# EasyEDA Pro project 双路调光版v0.2（立创eda专业版文件）.epro

# Board PCB2
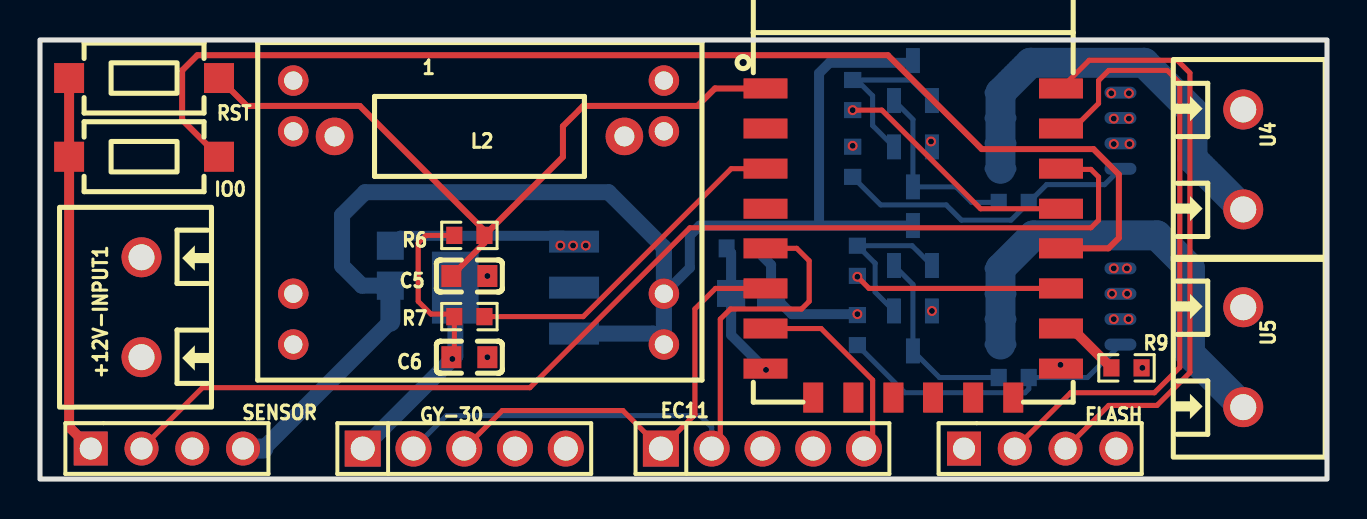
[diagram p0: board, top side]
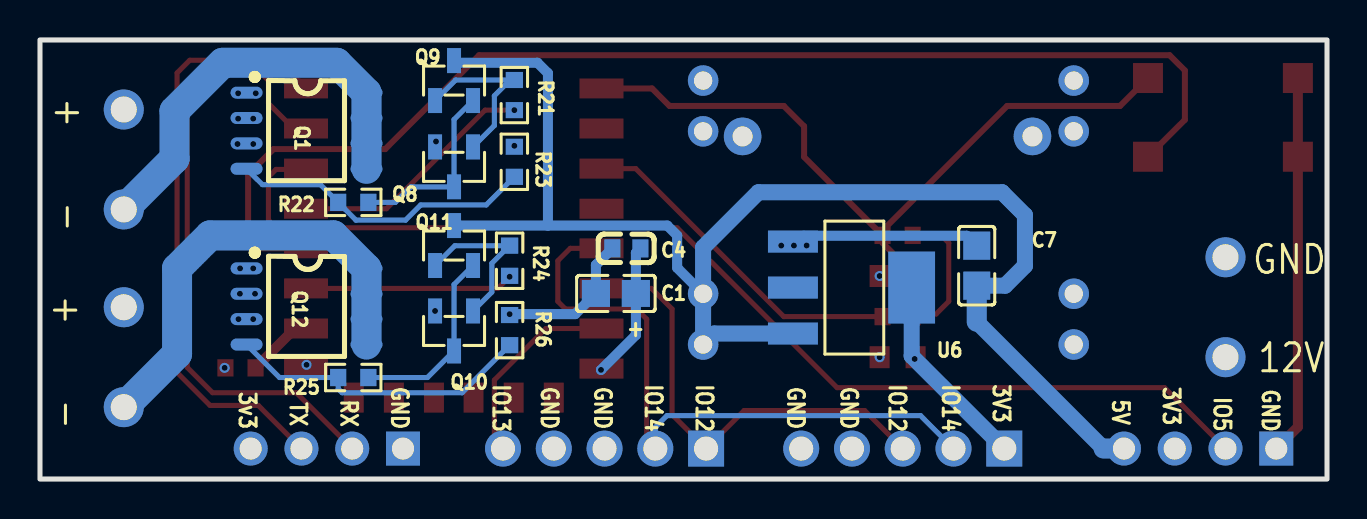
[diagram p1: board, bottom side, seen from below]

Outline 64.39 x 21.97 mm; copper layers: Top Layer, 电源层, GND层, Bottom Layer. Coordinates in mm from the lower left corner of the outline.
Outline path: rectangle 0,21.97 64.39,0
Stack: Top Layer 0.035mm 外层铜厚1oz / Dielectric1 0.2104mm 7628 RC49% 8.6mil / 电源层 0.0152mm 内层铜厚 / Dielectric2 1.065mm 1.1mm H/HOZ 含铜 / GND层 0.0152mm 内层铜厚 / Dielectric3 0.2104mm 7628 RC49% 8.6mil / Bottom Layer 0.035mm 外层铜厚1oz

## Design rules (mm)
template: 自定义配置
spacing copperThickness1oz (default): track to track 0.102, other pairs 0.152 to 0.3
spacing copperThickness2oz: track to track 0.203, other pairs 0.152 to 0.3
track width copperThickness1oz (default): min 0.127, default 0.254, max 3
track width copperThickness2oz: min 0.203, default 0.254, max 2.54
differential pair differentialPair (default): width min 0.127, default 0.254, max 2.54; gap min 0.152, default 0.152
via viaSize (default): diameter min 0.5, default 0.61, max 10; hole min 0.3, default 0.305, max 6.3

## Placement (name value [footprint] x y rotation side)
1  DC-DC  [电源模块]  22.45 12.83 0 top
+12V-INPUT1  SIP2  [CONN-TH_2P-P5.00_L7.6-W10.0]  5.08 8.6 90 top
C1  4.7uF  [C0805]  35.58 9.29 0 bottom
C4  0.1uf  [C0603#2]  35.05 11.54 180 bottom
C5  100nF  [C0603]  21.48 10.16 0 top
C6  100nF  [C0603]  21.48 6.1 180 top
C7  4.7uF  [C0805]  17.53 10.68 90 bottom
EC11  EC11  [HDR-TH_5P-P2.54-V_Z-211-0511-0021-001]  36.14 1.52 0 top
FLASH  FLASH  [HDR-TH_4P-P2.54-V]  50.04 1.52 0 top
GY-30  GY-30  [HDR-TH_5P-P2.54-V_Z-211-0511-0021-001]  21.23 1.52 0 top
IO0  BUTTON2,KEY  [KEY-SMD_L6.0-W3.5-LS8.0]  5.21 16.13 0 top
L2  磁环/0R电阻  [IND-TH_BD4.0-L10.5-P14.50-D0.6]  21.99 17.15 180 top
Q1  NCE3010S  [SOP-8_L4.9-W3.9-P1.27-LS6.0-BL]  51.05 17.43 270 bottom
Q8  S8550  [SOT-23-3_L2.9-W1.3-P1.90-LS2.4-BR]  43.67 15.62 90 bottom
Q9  S8050  [SOT-23-3_L2.9-W1.3-P1.90-LS2.4-BR]  43.67 19.94 270 bottom
Q10  S8550  [SOT-23-3_L2.9-W1.3-P1.90-LS2.4-BR]  43.67 7.41 90 bottom
Q11  S8050  [SOT-23-3_L2.9-W1.3-P1.90-LS2.4-BR]  43.67 11.68 270 bottom
Q12  NCE3010S  [SOP-8_L4.9-W3.9-P1.27-LS6.0-BL]  51.05 8.64 270 bottom
R6  10k  [R0603]  21.48 12.19 0 top
R7  10k  [R0603]  21.48 8.13 0 top
R9  10k  [R0603]  54.36 5.56 0 top
R21  100R  [R0603]  40.66 19.21 90 bottom
R22  100R  [R0603]  48.72 13.84 0 bottom
R23  10kΩ  [R0603]  40.66 15.88 270 bottom
R24  100R  [R0603]  40.89 10.92 90 bottom
R25  100R  [R0603]  48.72 5.08 0 bottom
R26  10kΩ  [R0603]  40.89 7.45 270 bottom
RST  BUTTON2,KEY  [KEY-SMD_L6.0-W3.5-LS8.0]  5.21 20.07 180 top
SENSOR  Sensor2  [HDR-TH_4P-P2.54-V]  6.35 1.53 0 top
U2  ESP8266-12F  [LGA22-2.0-24X16MM]  43.69 11.81 0 top
U4  WJ306V-5.0-2P-14-00A  [CONN-TH_2P-P5.00_L7.6-W10.0]  60.2 15.99 270 top
U5  WJ306V-5.0-2P-14-00A  [CONN-TH_2P-P5.00_L7.6-W10.0]  60.2 6.1 270 top
U6  AMS1117-3.3  [SOT-223-3_L6.5-W3.4-P2.30-LS7.0-BR]  23.75 9.58 0 bottom

## Footprints (pads in the part's own frame, mm; a bottom-side part is the same pattern mirrored in y, then rotated)
C0603
  rect 1x1.1 smd: 1(-0.9,0) 2(0.9,0)
C0603#2
  rect 0.8x0.9 smd: 1(-0.7,0) 2(0.7,0)
C0805
  rect 1.41x1.35 smd: 1(-1,0) 2(1,0)
CONN-TH_2P-P5.00_L7.6-W10.0
  round 2 hole 1.3: 1(-2.5,0) 2(2.5,0)
HDR-TH_4P-P2.54-V
  rect 1.7x1.7 hole 1.1: 1(-3.81,0)
  round 1.7 hole 1.1: 2(-1.27,0) 3(1.27,0) 4(3.81,0)
HDR-TH_5P-P2.54-V_Z-211-0511-0021-001
  rect 1.8x1.8 hole 1.2: 1(-5.08,0)
  round 1.8 hole 1.2: 2(-2.54,0) 3(0,0) 4(2.54,0) 5(5.08,0)
IND-TH_BD4.0-L10.5-P14.50-D0.6
  round 1.879 hole 1: 1(-7.25,0) 2(7.25,0)
KEY-SMD_L6.0-W3.5-LS8.0
  rect 1.5x1.5 smd: 1(-3.75,0) 2(3.75,0)
LGA22-2.0-24X16MM
  rect 2.2x1.001 smd: 1(-7.391,7.734) 2(-7.391,5.728) 3(-7.391,3.721) 4(-7.391,1.714) 5(-7.391,-0.267) 6(-7.391,-2.273) 7(-7.391,-4.28) 8(-7.391,-6.287) 15(7.391,-6.287) 16(7.391,-4.28) 17(7.391,-2.273) 18(7.391,-0.267) 19(7.391,1.714) 20(7.391,3.721) 21(7.391,5.728) 22(7.391,7.734)
  rect 1.001x1.501 smd: 9(-5.004,-7.734) 10(-2.997,-7.734) 11(-0.991,-7.734) 12(0.991,-7.734) 13(2.997,-7.734) 14(5.004,-7.734)
R0603
  rect 0.806x0.864 smd: 1(-0.753,0) 2(0.753,0)
SOP-8_L4.9-W3.9-P1.27-LS6.0-BL
  oval 0.6x1.6 smd: 1(-1.905,-3) 2(-0.635,-3) 3(0.635,-3) 4(1.905,-3) 5(1.905,3) 6(0.635,3) 7(-0.635,3) 8(-1.905,3)
SOT-23-3_L2.9-W1.3-P1.90-LS2.4-BR
  rect 1.25x0.7 smd: 1(1,-0.95) 2(1,0.95) 3(-1,0)
SOT-223-3_L6.5-W3.4-P2.30-LS7.0-BR
  rect 2.5x1.1 smd: 1(2.97,-2.3) 2(2.97,0) 3(2.97,2.3)
  rect 2.34x3.6 smd: 4(-2.97,0)
电源模块
  round 1.524 hole 0.914: 1(-9.779,-3.556) 1(-9.779,-6.096) 2(-9.779,7.112) 2(-9.779,4.572) 3(8.763,-3.556) 3(8.763,-6.096) 4(8.763,7.112) 4(8.763,4.572)

## Nets
+3.3V: C1.1 C4.2 C6.2 FLASH.4 GY-30.1 R6.1 R7.1 SENSOR.3 U2.8 U6.4
+5V: 1.3 C7.1 Q9.3 Q11.3 SENSOR.4 U6.3
+12V: 1.1 +12V-INPUT1.1 U4.1 U5.1
GND: 1.4 C1.2 C4.1 C5.2 C6.1 C7.2 EC11.3 EC11.4 FLASH.1 GY-30.4 GY-30.5 IO0.1 L2.1 Q8.2 Q10.2 R9.2 R23.1 R26.1 RST.2 SENSOR.1 U2.15 U6.1
GND-P: 1.2 +12V-INPUT1.2 L2.2 Q1.1 Q1.2 Q1.3 Q12.1 Q12.2 Q12.3
ADC: U2.2
CS0: U2.9
EN: R7.2 U2.3
GPIO0: IO0.2 U2.18
GPIO2: R24.1 U2.17
GPIO4: R21.1 U2.19
GPIO5: SENSOR.2 U2.20
GPIO9: U2.11
GPIO10: U2.12
GPIO12: EC11.1 GY-30.3 U2.6
GPIO13: EC11.5 U2.7
GPIO14: EC11.2 GY-30.2 U2.5
GPIO15: R9.1 U2.16
GPIO16: U2.4
MISO: U2.10
MOSI: U2.13
NRST: C5.1 R6.2 RST.1 U2.1
RXD0-GPIO3: FLASH.2 U2.21
SCLK: U2.14
TXD0-GPIO1: FLASH.3 U2.22
$1N1917: Q1.4 R22.2 R23.2
$1N1932: Q8.1 Q9.1 R21.2
$1N1934: Q8.3 Q9.2 R22.1
$1N2139: Q1.5 Q1.6 Q1.7 Q1.8 U4.2
$1N2445: Q12.4 R25.2 R26.2
$1N2450: Q10.1 Q11.1 R24.2
$1N2451: Q10.3 Q11.2 R25.1
$1N2457: Q12.5 Q12.6 Q12.7 Q12.8 U5.2

Pads without a net: U6 2

## Via types
v1: diameter 0.5, hole 0.3, Top Layer to Bottom Layer, 27 vias

## Routing (per net, layer and track width the routed paths; a pad name or vN(x,y) marks a point on that pad's centre or on a via; arc(x,y) is an arc through that point)
+3.3V: length 78.5
  Top Layer w0.254: C6.2 20.73,6.24 R7.1 20.6,8.26 19.56,8.26 18.92,8.89 18.92,11.81 19.3,12.19 R6.1
  电源层 w0.5: v1(20.63,6.01) 22.07,4.57 35.43,4.57 v1(36.32,5.46) 49.91,5.46 FLASH.4 ; GY-30.1 20.57,5.95 20.57,6.22
  电源层 w0.8: SENSOR.3 9.65,3.56 14.11,3.56 GY-30.1
  Bottom Layer w0.5: v1(36.32,5.46) 34.58,7.21 C1.1 34.58,11.32 C4.2
  Bottom Layer w0.8: U6.4 20.78,6.16 GY-30.1
+5V: length 71.9
  Bottom Layer w0.5: Q9.3 43.56,20.83 39.5,20.83 38.98,20.31 38.98,12.68 ; 38.98,12.68 Q11.3 ; 38.98,12.68 33,12.68 32.51,12.19 32.51,10.57 31.21,9.27
  Bottom Layer w0.8: C7.1 16.11,9.68 15.11,10.67 15.11,13.21 16.26,14.35 28.45,14.35 31.21,11.59 1.3 30.66,7.28 U6.3 ; 17.53,7.87 11.18,1.53
  Bottom Layer w1: 17.53,7.87 C7.1 ; 11.18,1.53 SENSOR.4
+12V: length 69.8
  电源层 w3: 5.08,6.06 12,6.06 1.1 12.67,9.88 16.76,13.97 55.22,13.97 ; 55.22,13.97 55.8,13.97 60.2,18.37 ; 55.22,13.97 55.22,13.24 58.55,9.91 58.55,9.65 59.14,9.65 U5.1
GND: length 35.9
  Top Layer w0.5: SENSOR.1 1.46,2.61 IO0.1 RST.2
  Bottom Layer w0.5: C4.1 36.58,10.72 C1.2 37.61,8.25 v1(40.89,8.25) ; C7.2 18.03,12.18 26.18,12.18 v1(26.67,11.68)
  vias: v1(22.38,10.16) v1(22.38,6.1) v1(26.03,11.68) v1(27.3,11.68) v1(40.66,16.68) v1(44.58,16.89) v1(44.62,8.41) v1(51.05,5.72) v1(55.15,5.56)
GND-P: length 67.1
  GND层 w2: 14.48,17.4 L2.2 ; 1.2 12.67,17.4
  GND层 w3: 53.75,14.88 52.96,14.1 17.79,14.1 L2.2 ; 53.75,14.88 54.1,15.24 54.1,19.69 ; 53.75,14.88 54.1,14.53 54.1,8.38 ; 14.48,17.4 12.67,17.4 6.41,11.14 5.08,11.14
  vias: v1(53.59,19.3) v1(53.63,9.27) v1(53.72,18.03) v1(53.72,16.76) v1(53.72,10.54) v1(53.72,8) v1(54.38,10.54) v1(54.39,9.27) v1(54.48,19.3) v1(54.48,18.03) v1(54.51,16.76) v1(54.46,8)
EN: length 17.1
  Top Layer w0.254: U2.3 34.58,15.53 27.18,8.13 R7.2
GPIO0: length 61
  Top Layer w0.3: U2.18 53.45,11.54 53.98,12.07 53.98,15.24 52.7,16.51 47.12,16.51 42.42,21.21 7.87,21.21 7.11,20.45 7.11,17.97 IO0.2
GPIO2: length 10.4
  Top Layer w0.254: U2.17 41.48,9.54 v1(40.89,10.12)
GPIO4: length 12.5
  Top Layer w0.254: v1(40.66,18.46) 42.12,18.46 47.05,13.53 U2.19
GPIO5: length 56.8
  Top Layer w0.254: U2.20 51.12,15.49 52.58,15.49 52.96,15.11 52.96,12.95 52.58,12.57 32.51,12.57 24.51,4.57 8.13,4.57 SENSOR.2
GPIO12: length 23.1
  Top Layer w0.254: U2.6 33.79,9.54 32.77,8.51 32.77,3.23 EC11.1 29.16,3.43 23.13,3.43 GY-30.3
GPIO13: length 10
  Top Layer w0.254: EC11.5 41.66,1.96 41.66,4.95 39.08,7.53 U2.7
GPIO14: length 32.9
  Top Layer w0.254: U2.5 37.86,11.54 38.48,10.92 38.48,8.89 38.1,8.51 34.54,8.51 34.04,8 34.04,1.96 EC11.2
  Bottom Layer w0.254: GY-30.2 20.34,3.18 33.02,3.18 33.6,2.59 EC11.2
GPIO15: length 3.3
  Top Layer w0.5: R9.1 51.63,7.53 U2.16
NRST: length 37.4
  Top Layer w0.3: R6.2 22.24,12.44 16,18.67 10.35,18.67 RST.1 ; R6.2 26.16,16.12 26.16,17.65 27.18,18.67 32.89,18.67 33.77,19.55 U2.1 ; R6.2 22.24,11.81 C5.1
RXD0-GPIO3: length 32.2
  Top Layer w0.254: U2.21 51.7,17.54 52.96,18.8 52.96,19.94 53.47,20.45 56.39,20.45 57.02,19.81 57.02,5.59 55.75,4.32 51.56,4.32 FLASH.2
TXD0-GPIO1: length 30.1
  Top Layer w0.254: U2.22 52.49,20.96 56.9,20.96 57.53,20.32 57.53,5.33 55.88,3.68 53.47,3.68 FLASH.3
$1N1917: length 15.4
  Bottom Layer w0.254: R23.2 42.06,13.72 45.34,13.72 46.1,12.95 48.58,12.95 50.36,14.73 53.26,14.73 Q1.4
$1N1932: length 8.5
  Bottom Layer w0.254: 40.87,19.97 43.6,19.97 Q9.1 ; 40.87,19.97 41.66,19.18 41.66,17.69 Q8.1 ; 40.87,19.97 40.66,19.97
$1N1934: length 9.3
  Bottom Layer w0.254: R22.1 46.61,13.84 45.83,14.62 Q8.3 43.67,17.99 Q9.2
$1N2139: length 21
  Bottom Layer w1.5: U4.2 57.66,16.03 57.66,18.42 55.24,20.83 49.55,20.83 Q1.8 Q1.7 Q1.6 Q1.5
$1N2445: length 15.5
  Bottom Layer w0.254: Q12.4 52.4,5.08 49.47,5.08 49.47,4.51 49.28,4.32 43.27,4.32 R26.2
$1N2450: length 8.2
  Bottom Layer w0.254: Q11.1 43.63,11.68 40.9,11.68 ; 40.9,11.68 41.78,10.8 41.78,9.35 Q10.1 ; 40.9,11.68 R24.2
$1N2451: length 9.5
  Bottom Layer w0.254: Q11.2 43.67,9.73 Q10.3 45,5.08 R25.1
$1N2457: length 22.7
  Bottom Layer w1.5: Q12.5 Q12.6 Q12.8 49.7,12.19 55.88,12.19 57.53,10.54 57.53,6.26 U5.2

## Copper pours and planes (outline as drawn; the poured copper is in the pictures)
GND on GND层: 0,21.97 64.39,21.97 64.39,0 0,0

## Text on the board
Bottom Silkscreen Layer: GND | IO5 | 3V3 | 5V | IO14 | IO12 | IO13 | RX | TX | 3v3 | + | - | 12V
